# EAGLE schematic M_D_ext_power-with_d (EAGLE 9.6.2)
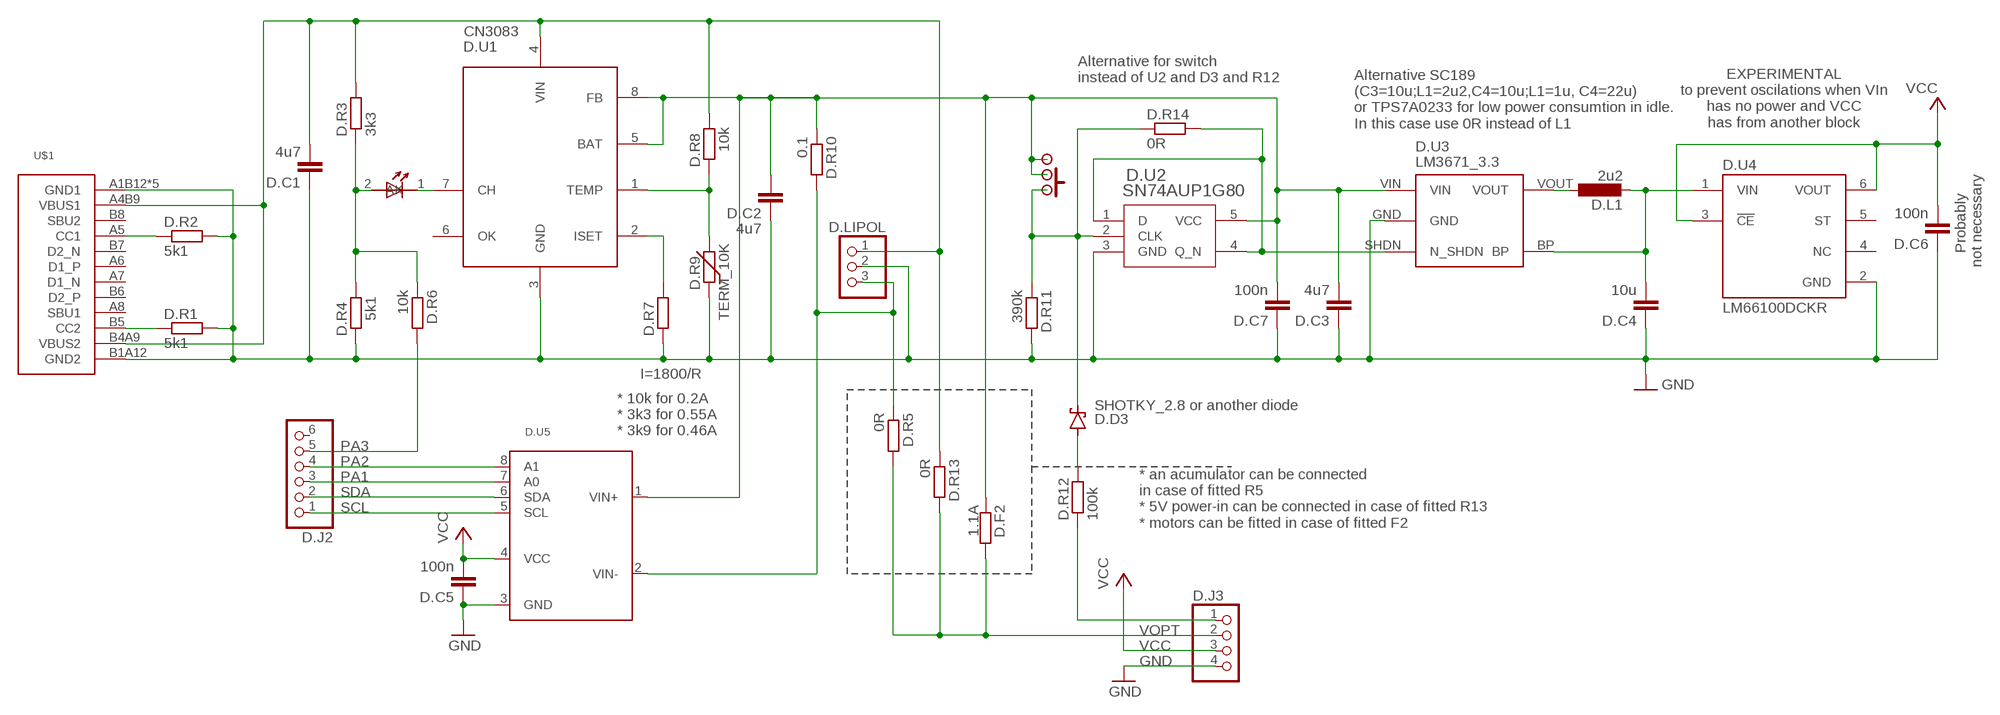
[diagram p0: schematic, sheet 1]

## Parts
D.C1  4u7  C-EUC0603  [C0603]
D.C2  4u7  C-EUC0603  [C0603]
D.C3  4u7  C-EUC0603  [C0603]
D.C4  10u  C-EUC0603  [C0603]
D.C5  100n  C-EUC0603  [C0603]
D.C6  100n  C-EUC0603  [C0603]
D.C7  100n  C-EUC0603  [C0603]
D.D1  LED_1.8  [LED_1.8]
D.D3  SHOTKY_2.8 or another diode  SHOTKY_2.8  [SHOTKY_2.8]
D.F2  1.1A  R-EU_R0805  [R0805]
D.J2  PINHD-1X6  [1X06]
D.J3  PINHD-1X4  [1X04]
D.L1  2u2  L-EUL3230M  [L3230M]
D.LIPOL  PINHEAD-1X3-2  [1X-03-2]
D.ON/OFF/RESET  SWITCH  [SWITCH]
D.R1  5k1  R-EU_R0603  [R0603]
D.R2  5k1  R-EU_R0603  [R0603]
D.R3  3k3  R-EU_R0603  [R0603]
D.R4  5k1  R-EU_R0603  [R0603]
D.R5  0R  R-EU_R0603  [R0603]
D.R6  10k  R-EU_R0603  [R0603]
D.R7  I=1800/R  R-EU_R0603  [R0603]
D.R8  10k  R-EU_R0603  [R0603]
D.R9  TERM_10K  THERM  [THERM]
D.R10  0.1  R-EU_R0805  [R0805]
D.R11  390k  R-EU_R0603  [R0603]
D.R12  100k  R-EU_R0603  [R0603]
D.R13  0R  R-EU_R0603  [R0603]
D.R14  0R  R-EU_R0603  [R0603]
D.U1  CN3083  [SOP8]
D.U2  SN74AUP1G80  SN74AUP1G80DCKRDCK0005A_M  [DCK0005A_M]
D.U3  LM3671_3.3  STABILISER_APE8865  [SOT32-5]
D.U4  LM66100DCKR  [SOT65P210X110-6N]
D.U5  INA219  [SOT23-8]
U$1  USB-C  [USB-C]

## Nets
5V: D.C1.2 D.LIPOL.1 D.R3.2 D.R8.2 D.R13.1 D.U1.4(VIN) U$1.A4B9(VBUS1) U$1.B4A9(VBUS2)
CHRG: D.D1.2(A) D.R3.1 D.R4.2 D.R6.1
GND: D.C1.1 D.C2.1 D.C3.1 D.C4.1 D.C5.1 D.C6.1 D.C7.1 D.J3.4 D.LIPOL.2 D.R1.2 D.R2.2 D.R4.1 D.R7.1 D.R9.1 D.R11.2 D.U1.3(GND) D.U2.3(GND) D.U3.GND D.U4.2(GND) D.U5.3(GND) U$1.A1B12(GND1) U$1.B1A12(GND2) U$1.SH1(GND1) U$1.SH2(GND1) U$1.SH3(GND1) U$1.SH4(GND1)
IN+: D.C2.2 D.C3.2 D.C7.2 D.F2.1 D.ON/OFF/RESET.P$2 D.ON/OFF/RESET.P$3 D.ON/OFF/RESET.P$4 D.ON/OFF/RESET.P$6 D.R10.1 D.U1.5(BAT) D.U1.8(FB) D.U2.5(VCC) D.U3.VIN D.U5.1(VIN+)
IN-: D.LIPOL.3 D.R5.1 D.R10.2 D.U5.2(VIN-)
N$2: D.L1.1 D.U3.VOUT
N$3: D.D1.1(K) D.U1.7(CH)
N$4: D.R1.1 U$1.B5(CC2)
N$5: D.D3.A D.R12.2
N$6: D.R2.1 U$1.A5(CC1)
N$7: D.R7.2 D.U1.2(ISET)
N$8: D.R8.1 D.R9.2 D.U1.1(TEMP)
N$9: D.R14.2 D.U2.1(D) D.U2.4(Q_N) D.U3.SHDN(N_SHDN)
N$10: D.D3.K(C) D.ON/OFF/RESET.P$1 D.ON/OFF/RESET.P$5 D.ON/OFF/RESET.P$7 D.R11.1 D.R14.1 D.U2.2(CLK)
PA1: D.J2.3 D.U5.7(A0)
PA2: D.J2.4 D.U5.8(A1)
PA3: D.J2.5 D.R6.2
PA5-1: D.J3.1 D.R12.1
SCL: D.J2.1 D.U5.5(SCL)
SDA: D.J2.2 D.U5.6(SDA)
VCC: D.C5.2 D.C6.2 D.J3.3 D.U4.3(!CE) D.U4.6(VOUT) D.U5.4(VCC)
VCC1: D.C4.2 D.L1.2 D.U3.BP D.U4.1(VIN)
VOPT: D.F2.2 D.J3.2 D.R5.2 D.R13.2
Unconnected: D.J2.6 D.U1.6(OK) D.U4.4(NC) D.U4.5(ST) U$1.A6(D1_P) U$1.A7(D1_N) U$1.A8(SBU1) U$1.B6(D2_P) U$1.B7(D2_N) U$1.B8(SBU2)

## Notes on the sheet
- Alternative for switch
  instead of U2 and D3 and R12
- EXPERIMENTAL
  to prevent oscilations when VIn
  has no power and VCC
  has from another block
- Alternative SC189
  (C3=10u;L1=2u2,C4=10u;L1=1u, C4=22u)
  or TPS7A0233 for low power consumtion in idle. 
  In this case use 0R instead of L1
- Probably 
  not necessary
- * 10k for 0.2A
  * 3k3 for 0.55A
  * 3k9 for 0.46A
- * an acumulator can be connected 
  in case of fitted R5  
  * 5V power-in can be connected in case of fitted R13 
  * motors can be fitted in case of fitted F2

## Library data of the parts
D.C1-D.C7 = rcl:C-EU: CAPACITOR, European symbol; SPICEPREFIX: C
D.D1 = hugo:LED_1.8
D.D3 = hugo:SHOTKY_2.8
D.F2 D.R1-D.R8 D.R10-D.R14 = rcl:R-EU_: RESISTOR, European symbol; SPICEPREFIX: R
D.J2 = pinhead2:PINHD-1X6: PIN HEADER
D.J3 = pinhead2:PINHD-1X4: PIN HEADER
D.L1 = rcl:L-EU: INDUCTOR, European symbol; SPICEPREFIX: L
D.LIPOL = pinhead2:PINHEAD-1X3-2
D.ON/OFF/RESET = hugo:SWITCH
D.R9 = hugo:THERM
D.U1 = hugo:CN3083
D.U2 = SN74AUP1G80DCKR:SN74AUP1G80DCKR; COPYRIGHT: Copyright (C) 2026 Ultra Librarian. All rights reserved.; DATASHEET: https://www.ti.com/lit/gpn/sn74aup1g80; DESCRIPTION: Low-Power Single Postitive-Edge-Triggered D-Type Flip-Flop 5-SC70 -40 to 85; MANUFACTURER_NAME: Texas Instruments; MANUFACTURER_PART_NUMBER: SN74AUP1G80DCKR; REFDES: RefDes; TYPE: TYPE
D.U3 = !stavebnice03:STABILISER_APE8865
D.U4 = LM66100DCKR:LM66100DCKR: Check availability <https://pricing.snapeda.com/parts/LM66100DCKR/Texas%20Instruments/view-part?ref=eda>; AVAILABILITY: In Stock; CHECK_PRICES: https://www.snapeda.com/parts/LM66100DCKR/Texas+Instruments/view-part/?ref=eda; DESCRIPTION: 1.5-V to 5.5-V, 1.5-A, 0.5-µA IQ ideal diode with integrated FET; MF: Texas Instruments; MP: LM66100DCKR; PACKAGE: SOT-SC70-6 Texas Instruments; PRICE: None; SNAPEDA_LINK: https://www.snapeda.com/parts/LM66100DCKR/Texas+Instruments/view-part/?ref=snap
D.U5 = hugo:INA219: INA219 - I2C Current/Power Monitor Voltage Range: 0-26V Accuracy: 0.5% Temperature: -40°C - 125°C
U$1 = hugo:USB-C